# Altium project B106AA.PrjPcb (part 5 of 5)

## Sheet TH Sensor Output Socket.SchDoc: Air Temperature & Air Humidity Sensor Output Socket
size A4; ApprovedBy: Mehmet Günce Akkoyun; CheckedBy: Mehmet Günce Akkoyun; Author: Mehmet Günce Akkoyun; CompanyName: Ovoo Electronics; DrawnBy: Mehmet Günce Akkoyun; Engineer: Mehmet Günce Akkoyun; Organization: Ovoo Electronics; Address1: Küçük Ýhsaniye Mah.; Address2: Mýzraklý Sok. No:15; Address3: Meram / Konya; Address4: Turkiye; DocumentNumber: AA005; Revision: B106AA; SheetNumber: 30; SheetTotal: 37
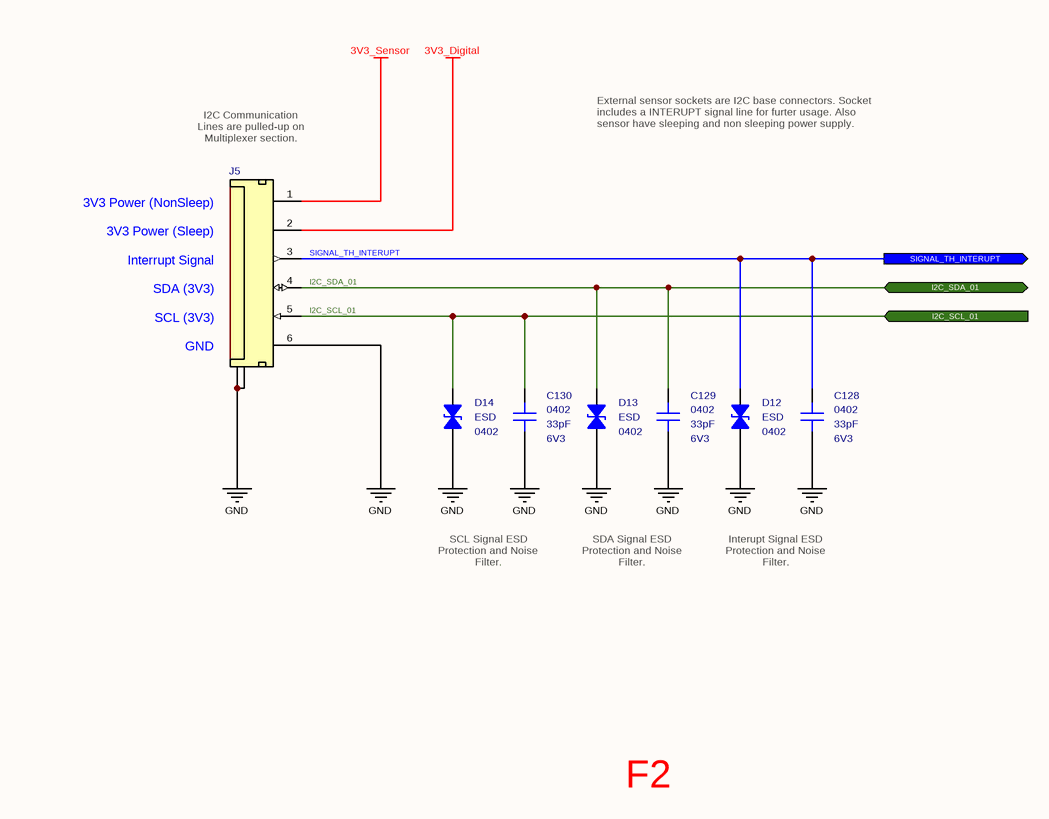
[diagram p35: TH Sensor Output Socket.SchDoc]

### Parts
C128  value 33pF  Case: 0402  Voltage: 6V3  [CAPACITOR_0402]  (hidden comment: Multilayer Ceramic Capacitor)
C129  value 33pF  Case: 0402  Voltage: 6V3  [CAPACITOR_0402]  (hidden comment: Multilayer Ceramic Capacitor)
C130  value 33pF  Case: 0402  Voltage: 6V3  [CAPACITOR_0402]  (hidden comment: Multilayer Ceramic Capacitor)
D12  Case: 0402  [ESD_0402]  (hidden comment: ESD Suppressors)
D13  Case: 0402  [ESD_0402]  (hidden comment: ESD Suppressors)
D14  Case: 0402  [ESD_0402]  (hidden comment: ESD Suppressors)
J5  T/H Sensor Socket  [Connector_Tunic 6P - H]  (value not drawn)

### Ports
I2C_SCL_01 (in), I2C_SDA_01 (bidir), SIGNAL_TH_INTERUPT (out)

### Nets
3V3_Digital: J5.2(3V3_Digital)
3V3_Sensor: J5.1(3V3_Sensor)
GND: C128.1 C129.1 C130.1 D12.1 D13.1 D14.1 J5.6(GND) J5.7(Termination) J5.8(Termination)
I2C_SCL_01: C130.2 D14.2 J5.5(SCL01) ; port I2C_SCL_01
I2C_SDA_01: C129.2 D13.2 J5.4(SDA01) ; port I2C_SDA_01
SIGNAL_TH_INTERUPT: C128.2 D12.2 J5.3(TH_Interupt) ; port SIGNAL_TH_INTERUPT

### Notes on the sheet
- I2C Communication Lines are pulled-up on Multiplexer section.
- External sensor sockets are I2C base connectors. Socket includes a INTERUPT signal line for furter usage. Also sensor have sleeping and non sleeping power supply.
- (near J5) 3V3 Power (NonSleep)
  3V3 Power (Sleep)
  Interrupt Signal
  SDA (3V3)
  SCL (3V3)
  GND
- SCL Signal ESD Protection and Noise Filter.
- SDA Signal ESD Protection and Noise Filter.
- Interupt Signal ESD Protection and Noise Filter.
- F2
- Title
- Size:
- Date:
- A4
- Number:
- Time:
- Revision:
- Sheet
- of
- File:
- (in symbol Diode - ESD Protection) ESD

### Library data of the parts
C128-C130 = Capacitor - 33pF [0402-6V3]: Capacitor - 33pF [0402] (Ceramic); Manufacturer_Name: Kemet; Manufacturer_Part_Number: C0402C330J9RACAUTO; Dielectric: X7R; Tolerance: 10%; Height: 0.5mm; Mouser_Part_Number: 80-C0402C330J9RAUTO; Maximum Operating Temperature: +125; Minimum Operating Temperature: -55; ROHS: Yes; ComponentLink1Description: DataSheet; ComponentLink1URL: https://api.kemet.com/component-edge/download/datasheet/C0402C330J9RACAUTO.pdf; ComponentLink2Description: Mouser; ComponentLink2URL: https://www.mouser.com/Search/Refine.aspx?Keyword=80-C0402C330J9RAUTO; Supplier 1: Mouser; Supplier Part Number 1: 80-C0402C330J9RAUTO
D12-D14 = Diode - ESD Protection: TVS Diode (Bi-directional); Manufacturer_Name: Bussmann / Eaton; Manufacturer_Part_Number: 0402ESDA-MLP1; Clamping Voltage: 35V; Diode Capacitance: 0.05pF; Polarity: Bidirectional; Voltage ESD Air Gap: 15kV; Voltage ESD Contact: 8kV; Working Voltage: 30V; Height: 0.436mm; Mouser_Part_Number: 504-0402ESDA-MLP1; Maximum Operating Temperature: +125; Minimum Operating Temperature: -55; ROHS: Yes; ComponentLink1Description: DataSheet; ComponentLink1URL: https://www.mouser.com.tr/datasheet/2/87/47c59e11-d058-4882-bc35-d8572f2ca054-38826.pdf; ComponentLink2Description: Mouser; ComponentLink2URL: https://www.mouser.com.tr/ProductDetail/Bussmann-Eaton/0402ESDA-MLP1?qs=%2Fha2pyFadughxyc7TyLWeW%2FUvipVY6Ex3naV%2FjpO3plZBZWDLqV4bw%3D%3D; Supplier 1: Mouser; Supplier 2: Digi-Key; Supplier Part Number 2: 283-2964-1-ND; Supplier Part Number 1: 504-0402ESDA-MLP1
J5 = Connector - Mini Tunic 6P (1.25): Mini Tunic Connector with 6P; Manufacturer_Name: Molex; Manufacturer_Part_Number: 53261-0671; ROHS: Yes; Supplier 1: Avnet; Supplier 2: Mouser; Supplier 3: Arrow; Supplier 4: Farnell; Supplier 5: Newark; Supplier 6: Digi-Key; Supplier Part Number 1: 0532610671; Supplier Part Number 2: 538-53261-0671; Supplier Part Number 3: 53261-0671; Supplier Part Number 4: 1125375; Supplier Part Number 5: 93K4246; Supplier Part Number 6: WM7624CT-ND; System: Connector

## Sheet ST Sensor Output Socket.SchDoc: Soil Temperature Sensor Output Socket
size A4; ApprovedBy: Mehmet Günce Akkoyun; CheckedBy: Mehmet Günce Akkoyun; Author: Mehmet Günce Akkoyun; CompanyName: Ovoo Electronics; DrawnBy: Mehmet Günce Akkoyun; Engineer: Mehmet Günce Akkoyun; Organization: Ovoo Electronics; Address1: Küçük Ýhsaniye Mah.; Address2: Mýzraklý Sok. No:15; Address3: Meram / Konya; Address4: Turkiye; DocumentNumber: AA005; Revision: B106AA; SheetNumber: 31; SheetTotal: 37
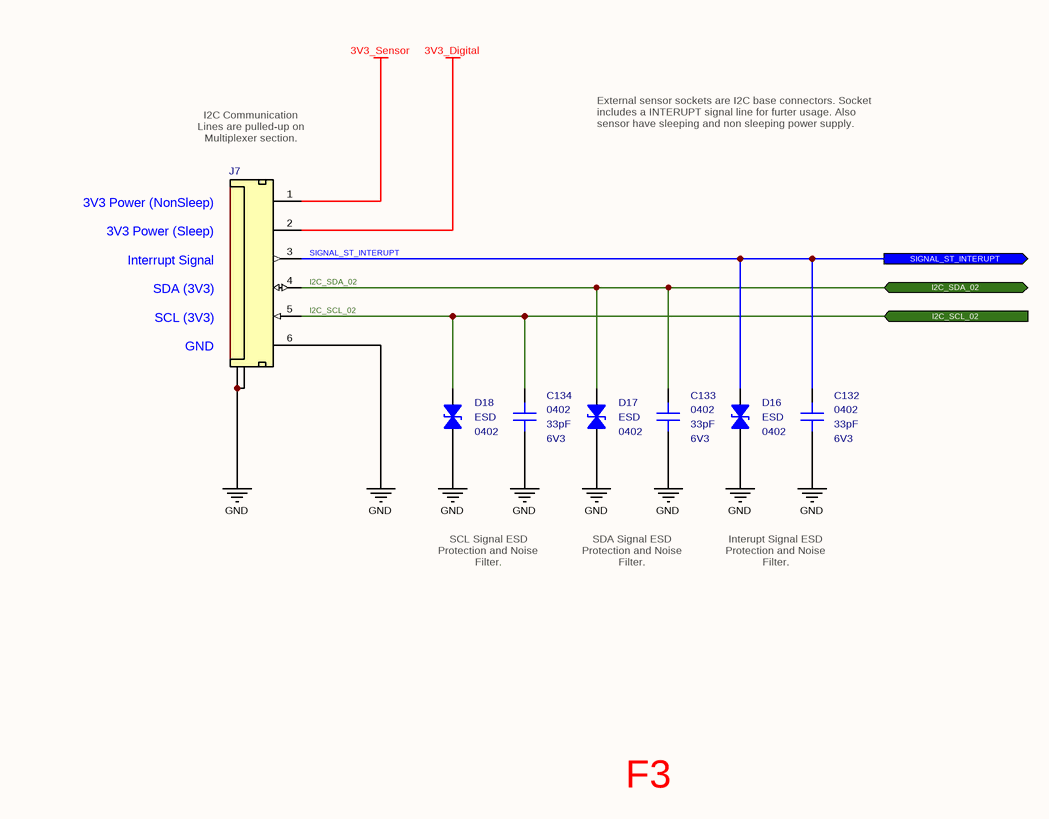
[diagram p36: ST Sensor Output Socket.SchDoc]

### Parts
C132  value 33pF  Case: 0402  Voltage: 6V3  [CAPACITOR_0402]  (hidden comment: Multilayer Ceramic Capacitor)
C133  value 33pF  Case: 0402  Voltage: 6V3  [CAPACITOR_0402]  (hidden comment: Multilayer Ceramic Capacitor)
C134  value 33pF  Case: 0402  Voltage: 6V3  [CAPACITOR_0402]  (hidden comment: Multilayer Ceramic Capacitor)
D16  Case: 0402  [ESD_0402]  (hidden comment: ESD Suppressors)
D17  Case: 0402  [ESD_0402]  (hidden comment: ESD Suppressors)
D18  Case: 0402  [ESD_0402]  (hidden comment: ESD Suppressors)
J7  ST Sensor Socket  [Connector_Tunic 6P - H]  (value not drawn)

### Ports
I2C_SCL_02 (in), I2C_SDA_02 (bidir), SIGNAL_ST_INTERUPT (out)

### Nets
3V3_Digital: J7.2(3V3_Digital)
3V3_Sensor: J7.1(3V3_Sensor)
GND: C132.1 C133.1 C134.1 D16.1 D17.1 D18.1 J7.6(GND) J7.7(Termination) J7.8(Termination)
I2C_SCL_02: C134.2 D18.2 J7.5(SCL02) ; port I2C_SCL_02
I2C_SDA_02: C133.2 D17.2 J7.4(SDA02) ; port I2C_SDA_02
SIGNAL_ST_INTERUPT: C132.2 D16.2 J7.3(ST_Interupt) ; port SIGNAL_ST_INTERUPT

### Notes on the sheet
- I2C Communication Lines are pulled-up on Multiplexer section.
- External sensor sockets are I2C base connectors. Socket includes a INTERUPT signal line for furter usage. Also sensor have sleeping and non sleeping power supply.
- (near J7) 3V3 Power (NonSleep)
  3V3 Power (Sleep)
  Interrupt Signal
  SDA (3V3)
  SCL (3V3)
  GND
- SCL Signal ESD Protection and Noise Filter.
- SDA Signal ESD Protection and Noise Filter.
- Interupt Signal ESD Protection and Noise Filter.
- F3
- Title
- Size:
- Date:
- A4
- Number:
- Time:
- Revision:
- Sheet
- of
- File:
- (in symbol Diode - ESD Protection) ESD

### Library data of the parts
C132-C134 = Capacitor - 33pF [0402-6V3]: as C128 on sheet TH Sensor Output Socket; Height: 0.5mm; Mouser_Part_Number: 80-C0402C330J9RAUTO; Maximum Operating Temperature: +125; Minimum Operating Temperature: -55; ROHS: Yes; ComponentLink1Description: DataSheet; ComponentLink1URL: https://api.kemet.com/component-edge/download/datasheet/C0402C330J9RACAUTO.pdf; ComponentLink2Description: Mouser; ComponentLink2URL: https://www.mouser.com/Search/Refine.aspx?Keyword=80-C0402C330J9RAUTO; Supplier 1: Mouser; Supplier Part Number 1: 80-C0402C330J9RAUTO
D16-D18 = Diode - ESD Protection: as D12 on sheet TH Sensor Output Socket; Height: 0.436mm; Mouser_Part_Number: 504-0402ESDA-MLP1; Maximum Operating Temperature: +125; Minimum Operating Temperature: -55; ROHS: Yes; ComponentLink1Description: DataSheet; ComponentLink1URL: https://www.mouser.com.tr/datasheet/2/87/47c59e11-d058-4882-bc35-d8572f2ca054-38826.pdf; ComponentLink2Description: Mouser; ComponentLink2URL: https://www.mouser.com.tr/ProductDetail/Bussmann-Eaton/0402ESDA-MLP1?qs=%2Fha2pyFadughxyc7TyLWeW%2FUvipVY6Ex3naV%2FjpO3plZBZWDLqV4bw%3D%3D; Supplier 1: Mouser; Supplier 2: Digi-Key; Supplier Part Number 2: 283-2964-1-ND; Supplier Part Number 1: 504-0402ESDA-MLP1
J7 = Connector - Mini Tunic 6P (1.25): as J5 on sheet TH Sensor Output Socket; ROHS: Yes; Supplier 1: Avnet; Supplier 2: Mouser; Supplier 3: Arrow; Supplier 4: Farnell; Supplier 5: Newark; Supplier 6: Digi-Key; Supplier Part Number 1: 0532610671; Supplier Part Number 2: 538-53261-0671; Supplier Part Number 3: 53261-0671; Supplier Part Number 4: 1125375; Supplier Part Number 5: 93K4246; Supplier Part Number 6: WM7624CT-ND; System: Connector

## Sheet Pressure Sensor.SchDoc: Pressure Sensor
size A4; ApprovedBy: Mehmet Günce Akkoyun; CheckedBy: Mehmet Günce Akkoyun; Author: Mehmet Günce Akkoyun; CompanyName: Ovoo Electronics; DrawnBy: Mehmet Günce Akkoyun; Engineer: Mehmet Günce Akkoyun; Organization: Ovoo Electronics; Address1: Küçük Ýhsaniye Mah.; Address2: Mýzraklý Sok. No:15; Address3: Meram / Konya; Address4: Turkiye; DocumentNumber: AA005; Revision: B106AA; SheetNumber: 32; SheetTotal: 37
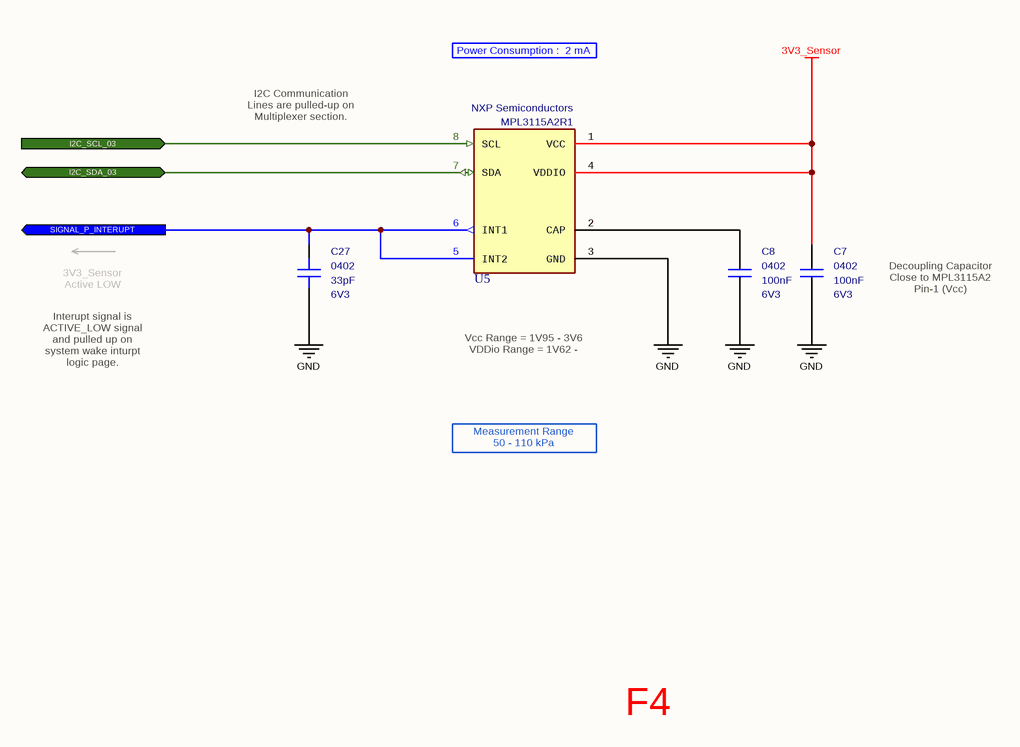
[diagram p37: Pressure Sensor.SchDoc]

### Parts
C7  value 100nF  Case: 0402  Voltage: 6V3  [CAPACITOR_0402]  (hidden comment: Multilayer Ceramic Capacitor)
C8  value 100nF  Case: 0402  Voltage: 6V3  [CAPACITOR_0402]  (hidden comment: Multilayer Ceramic Capacitor)
C27  value 33pF  Case: 0402  Voltage: 6V3  [CAPACITOR_0402]  (hidden comment: Multilayer Ceramic Capacitor)
U5  Manufacturer_Part_Number: MPL3115A2R1  Manufacturer_Name: NXP Semiconductors  [MPL3115A2]  (hidden comment: Board Mount Pressure Sensors)

### Ports
I2C_SCL_03 (in), I2C_SDA_03 (bidir), SIGNAL_P_INTERUPT (out)

### Nets
3V3_Sensor: C7.2 U5.1(VCC) U5.4(VDDIO)
GND: C7.1 C8.1 C27.1 U5.3(GND)
I2C_SCL_03: U5.8(SCL) ; port I2C_SCL_03
I2C_SDA_03: U5.7(SDA) ; port I2C_SDA_03
SIGNAL_P_INTERUPT: C27.2 U5.5(INT2) U5.6(INT1) ; port SIGNAL_P_INTERUPT
NetC8_2: C8.2 U5.2(CAP)

### Notes on the sheet
- Power Consumption :  2 mA
- I2C Communication Lines are pulled-up on Multiplexer section.
- 3V3_Sensor
  Active LOW
- Decoupling Capacitor
  Close to MPL3115A2
  Pin-1 (Vcc)
- Interupt signal is ACTIVE_LOW signal and pulled up on system wake inturpt logic page.
- Vcc Range = 1V95 - 3V6
  VDDio Range = 1V62 - 3V6
- Measurement Range
  50 - 110 kPa
- F4
- Title
- Size:
- Date:
- A4
- Number:
- Time:
- Revision:
- Sheet
- of
- File:

### Library data of the parts
C7 C8 = Capacitor - 100nF [0402-6V3]: Capacitor - 100nF [0402-6V3] (Ceramic); Manufacturer_Name: AVX; Manufacturer_Part_Number: 04026D104KAT4A; Dielectric: X5R; Tolerance: %10; Height: 0.25mm; Mouser_Part_Number: 581-04026D104KAT4A; ComponentLink1Description: Mouser; ComponentLink1URL: https://www.mouser.com.tr/ProductDetail/AVX/04026D104KAT4A?qs=sGAEpiMZZMs0AnBnWHyRQPg4iYkCw7IMED%2F4kpqgf7w%3D; ComponentLink2Description: DataSheet; ComponentLink2URL: https://www.mouser.com.tr/datasheet/2/40/cx5r-776519.pdf; ROHS: Yes; Maximum Operating Temperature: +85; Minimum Operating Temperature: -55; Supplier 1: Avnet; Supplier Part Number 1: 04026D104KAT4A
C27 = Capacitor - 33pF [0402-6V3]: as C128 on sheet TH Sensor Output Socket; Height: 0.5mm; Mouser_Part_Number: 80-C0402C330J9RAUTO; Maximum Operating Temperature: +125; Minimum Operating Temperature: -55; ROHS: Yes; ComponentLink1Description: DataSheet; ComponentLink1URL: https://api.kemet.com/component-edge/download/datasheet/C0402C330J9RACAUTO.pdf; ComponentLink2Description: Mouser; ComponentLink2URL: https://www.mouser.com/Search/Refine.aspx?Keyword=80-C0402C330J9RAUTO; Supplier 1: Mouser; Supplier Part Number 1: 80-C0402C330J9RAUTO
U5 = IC - MPL3115A2R1: Board Mount Pressure Sensors I 2 C VERSION; Mouser Part Number: 841-MPL3115A2R1; ComponentLink1Description: DataSheet; ComponentLink1URL: https://www.mouser.com.tr/datasheet/2/302/MPL3115A2-1127148.pdf; ComponentLink2Description: Mouser; ComponentLink2URL: https://www.mouser.com.tr/ProductDetail/NXP-Semiconductors/MPL3115A2R1?qs=6ddF3R%2F6EV%2Fx8daKoNGetQ%3D%3D; Minimum Operating Temperature: -40; Maximum Operating Temperature: +85; Case: SMD; Supplier 1: Farnell; Supplier Part Number 1: 2890337

## Sheet Capacitive Rain Sensor.SchDoc: Capacitive Rain Sensor
size A4; ApprovedBy: Mehmet Günce Akkoyun; CheckedBy: Mehmet Günce Akkoyun; Author: Mehmet Günce Akkoyun; CompanyName: Ovoo Electronics; DrawnBy: Mehmet Günce Akkoyun; Engineer: Mehmet Günce Akkoyun; Organization: Ovoo Electronics; Address1: Küçük Ýhsaniye Mah.; Address2: Mýzraklý Sok. No:15; Address3: Meram / Konya; Address4: Turkiye; DocumentNumber: AA005; Revision: B106AA; SheetNumber: 33; SheetTotal: 37
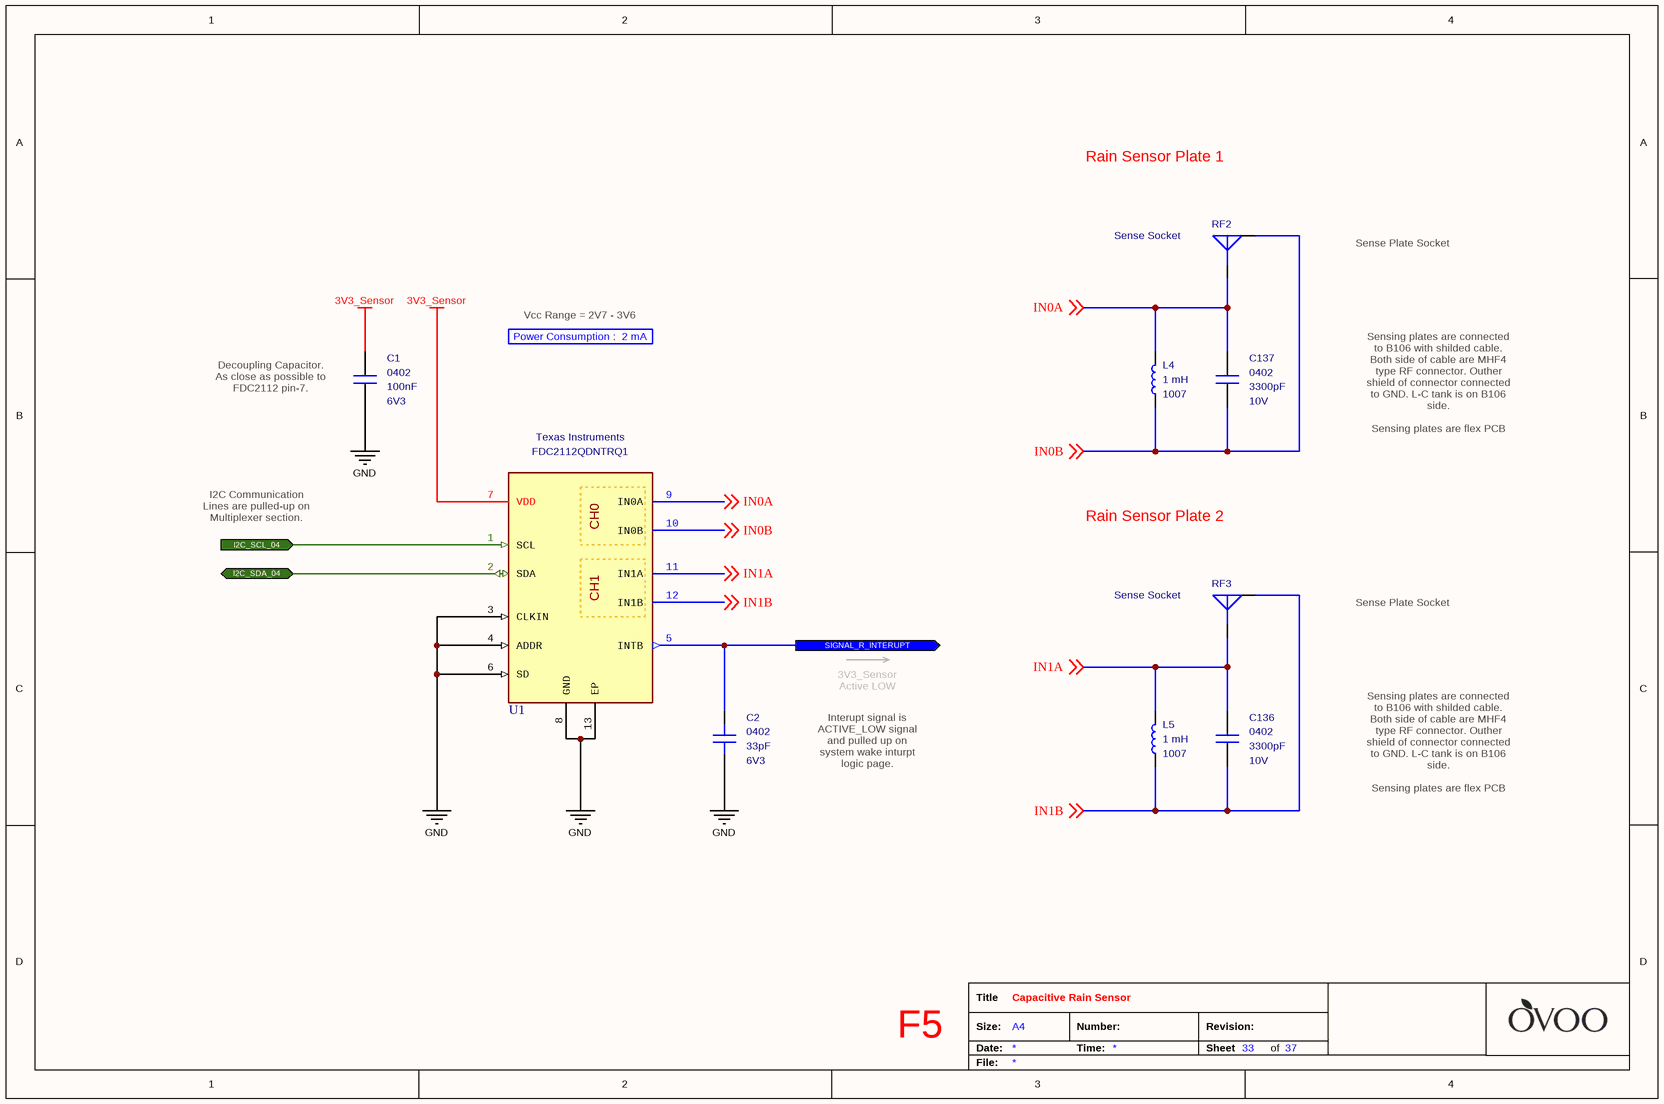
[diagram p38: Capacitive Rain Sensor.SchDoc]

### Parts
C1  value 100nF  Case: 0402  Voltage: 6V3  [CAPACITOR_0402]  (hidden comment: Multilayer Ceramic Capacitor)
C2  value 33pF  Case: 0402  Voltage: 6V3  [CAPACITOR_0402]  (hidden comment: Multilayer Ceramic Capacitor)
C136  value 3300pF  Case: 0402  Voltage: 10V  [CAPACITOR_0402]  (hidden comment: Multilayer Ceramic Capacitors)
C137  value 3300pF  Case: 0402  Voltage: 10V  [CAPACITOR_0402]  (hidden comment: Multilayer Ceramic Capacitors)
L4  value 1 mH  Case: 1007  [INDUCTOR_1007]  (hidden comment: Fixed Inductor)
L5  value 1 mH  Case: 1007  [INDUCTOR_1007]  (hidden comment: Fixed Inductor)
RF2  Sense Socket  [Connector_IPEX]
RF3  Sense Socket  [Connector_IPEX]
U1  Manufacturer_Part_Number: FDC2112QDNTRQ1  Manufacturer_Name: Texas Instruments  [Texas_DNT]  (hidden comment: Capacitive Sensor)

### Ports
I2C_SCL_04 (in), I2C_SDA_04 (bidir), SIGNAL_R_INTERUPT (out)

### Nets
3V3_Sensor: C1.2 U1.7(VDD)
GND: C1.1 C2.1 U1.3(CLKIN) U1.4(ADDR) U1.6(SD) U1.8(GND) U1.13(EP)
I2C_SCL_04: U1.1(SCL) ; port I2C_SCL_04
I2C_SDA_04: U1.2(SDA) ; port I2C_SDA_04
IN0A: C137.2 L4.2 RF2.1(Signal) U1.9(IN0A) ; off-sheet IN0A
IN0B: C137.1 L4.1 RF2.2(GND) U1.10(IN0B) ; off-sheet IN0B
IN1A: C136.2 L5.2 RF3.1(Signal) U1.11(IN1A) ; off-sheet IN1A
IN1B: C136.1 L5.1 RF3.2(GND) U1.12(IN1B) ; off-sheet IN1B
SIGNAL_R_INTERUPT: C2.2 U1.5(INTB) ; port SIGNAL_R_INTERUPT

### Notes on the sheet
- Rain Sensor Plate 1
- Sense Plate Socket
- Vcc Range = 2V7 - 3V6
- (near C1) Decoupling Capacitor. As close as possible to FDC2112 pin-7.
- Power Consumption :  2 mA
- Sensing plates are connected to B106 with shilded cable. Both side of cable are MHF4 type RF connector. Outher shield of connector connected to GND. L-C tank is on B106 side.
  Sensing plates are flex PCB and stick to inside of enclosure.
- I2C Communication Lines are pulled-up on Multiplexer section.
- Rain Sensor Plate 2
- 3V3_Sensor
  Active LOW
- Interupt signal is ACTIVE_LOW signal and pulled up on system wake inturpt logic page.
- F5
- Title
- Size:
- Date:
- A4
- Number:
- Time:
- Revision:
- Sheet
- of
- File:
- (in symbol IC - FDC2112QDNTRQ1) CH0; CH1

### Library data of the parts
C1 = Capacitor - 100nF [0402-6V3]: as C7 on sheet Pressure Sensor; Height: 0.25mm; Mouser_Part_Number: 581-04026D104KAT4A; ComponentLink1Description: Mouser; ComponentLink1URL: https://www.mouser.com.tr/ProductDetail/AVX/04026D104KAT4A?qs=sGAEpiMZZMs0AnBnWHyRQPg4iYkCw7IMED%2F4kpqgf7w%3D; ComponentLink2Description: DataSheet; ComponentLink2URL: https://www.mouser.com.tr/datasheet/2/40/cx5r-776519.pdf; ROHS: Yes; Maximum Operating Temperature: +85; Minimum Operating Temperature: -55; Supplier 1: Avnet; Supplier Part Number 1: 04026D104KAT4A
C2 = Capacitor - 33pF [0402-6V3]: as C128 on sheet TH Sensor Output Socket; Height: 0.5mm; Mouser_Part_Number: 80-C0402C330J9RAUTO; Maximum Operating Temperature: +125; Minimum Operating Temperature: -55; ROHS: Yes; ComponentLink1Description: DataSheet; ComponentLink1URL: https://api.kemet.com/component-edge/download/datasheet/C0402C330J9RACAUTO.pdf; ComponentLink2Description: Mouser; ComponentLink2URL: https://www.mouser.com/Search/Refine.aspx?Keyword=80-C0402C330J9RAUTO; Supplier 1: Mouser; Supplier Part Number 1: 80-C0402C330J9RAUTO
C136 C137 = Capacitor - 3300pF [0402-10V): Capacitor - 3300pF [0402] (Ceramic); Manufacturer_Name: Vishay; Manufacturer_Part_Number: VJ0402Y332KXQCW1BC; Dielectric: X7R; Tolerance: %10; Height: 0.5mm; Mouser_Part_Number: 77-VJ0402Y332KXQCBC; ComponentLink1Description: Mouser; ComponentLink1URL: https://www.mouser.com.tr/ProductDetail/Vishay-Vitramon/VJ0402Y332KXQCW1BC?qs=KbkO2%2FpCUcHZJP6qGqcwFw%3D%3D; ComponentLink2Description: DataSheet; ComponentLink2URL: https://www.mouser.com.tr/datasheet/2/427/vjw1bcbascomseries-1762447.pdf; ROHS: Yes; Maximum Operating Temperature: +125; Minimum Operating Temperature: -55; Supplier 1: Mouser; Supplier Part Number 1: 77-VJ0402Y332KXQCBC
L4 L5 = Inductor - 1mH [1007]: Manufacturer_Name: Taiyo Yuden; Manufacturer_Part_Number: CB2518T102K; Height: 1.8mm; Mouser_Part_Number: 963-CB2518T102K; ComponentLink1Description: DataSheet; ComponentLink1URL: https://www.mouser.com.tr/datasheet/2/396/wound02_e-13113-1206718.pdf; ComponentLink2Description: Mouser; ComponentLink2URL: https://www.mouser.com.tr/ProductDetail/Taiyo-Yuden/CB2518T102K?qs=I6KAKw0tg2xhj02bt1Q%2F3g%3D%3D; Supplier 1: Mouser; Supplier 2: Farnell; Supplier 3: Newark; Supplier 4: Digi-Key; Supplier Part Number 1: 963-CB2518T102K; Supplier Part Number 2: 2084589; Supplier Part Number 3: 04R7508; Supplier Part Number 4: 587-2195-1-ND
RF2 RF3 = Connector - MHF: Sense Plate Connection Socket; ROHS: Yes; Supplier 1: Mouser; Supplier 2: Arrow; Supplier Part Number 1: 200-RSP-122811-01; Supplier Part Number 2: RSP-122811-01; System: Connector
U1 = IC - FDC2112QDNTRQ1: Mouser Part Number: 595-FDC2112QDNTRQ1; ComponentLink1Description: DataSheet; ComponentLink1URL: http://www.ti.com/general/docs/suppproductinfo.tsp?distId=26&gotoUrl=http%3A%2F%2Fwww.ti.com%2Flit%2Fgpn%2Ffdc2112-q1; ComponentLink2Description: Mouser; ComponentLink2URL: https://www.mouser.com.tr/ProductDetail/Texas-Instruments/FDC2112QDNTRQ1?qs=zEmsApcVOkVPXFPq8EWl0A%3D%3D; Supplier 1: Mouser; Supplier 2: Arrow; Supplier Part Number 1: 595-FDC2112QDNTRQ1; Supplier Part Number 2: FDC2112QDNTRQ1; Case: WSON-12

## Sheet Real Time Clock.SchDoc: Real Time Clock
size A4; ApprovedBy: Mehmet Günce Akkoyun; CheckedBy: Mehmet Günce Akkoyun; Author: Mehmet Günce Akkoyun; CompanyName: Ovoo Electronics; DrawnBy: Mehmet Günce Akkoyun; Engineer: Mehmet Günce Akkoyun; Organization: Ovoo Electronics; Address1: Küçük Ýhsaniye Mah.; Address2: Mýzraklý Sok. No:15; Address3: Meram / Konya; Address4: Turkiye; DocumentNumber: AA005; Revision: B106AA; SheetNumber: 36; SheetTotal: 37
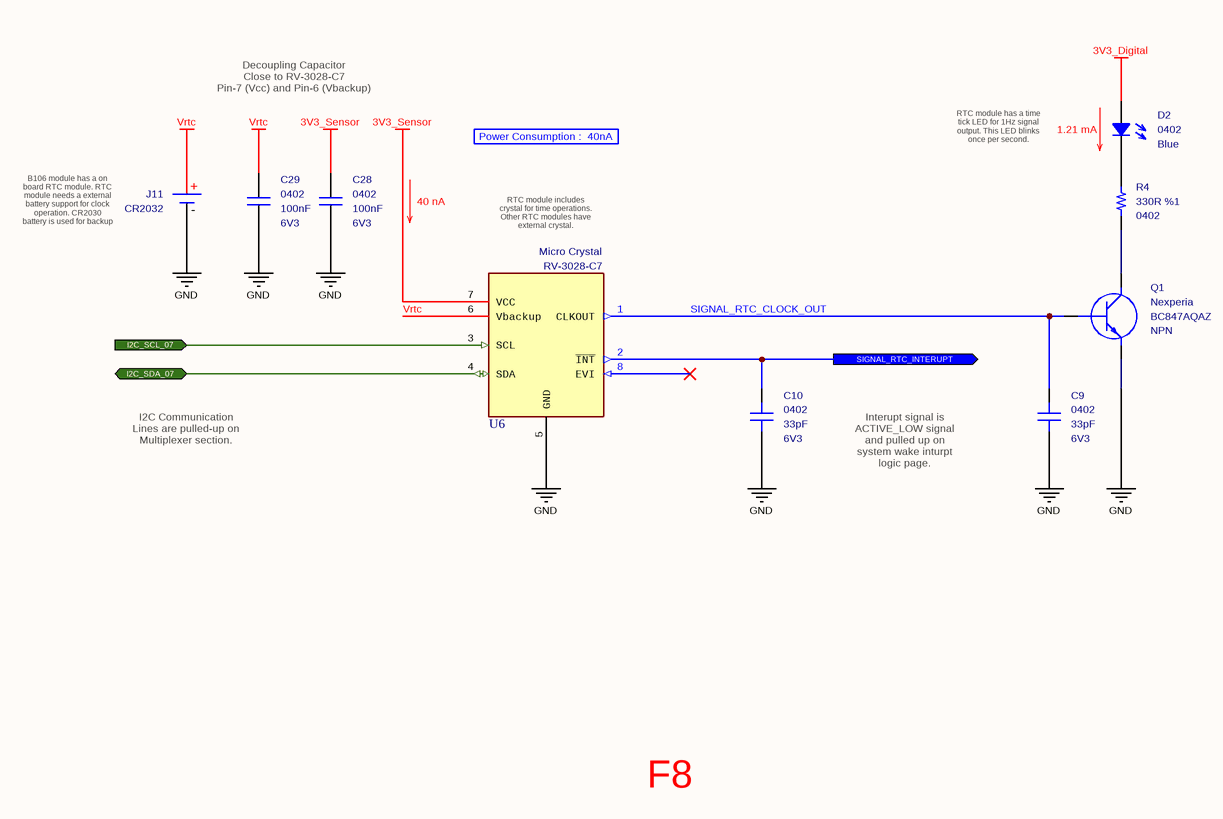
[diagram p39: Real Time Clock.SchDoc]

### Parts
C9  value 33pF  Case: 0402  Voltage: 6V3  [CAPACITOR_0402]  (hidden comment: Multilayer Ceramic Capacitor)
C10  value 33pF  Case: 0402  Voltage: 6V3  [CAPACITOR_0402]  (hidden comment: Multilayer Ceramic Capacitor)
C28  value 100nF  Case: 0402  Voltage: 6V3  [CAPACITOR_0402]  (hidden comment: Multilayer Ceramic Capacitor)
C29  value 100nF  Case: 0402  Voltage: 6V3  [CAPACITOR_0402]  (hidden comment: Multilayer Ceramic Capacitor)
D2  Case: 0402  Color: Blue  [LED_0402]  (hidden comment: SMD LED (Blue))
J11  Battery Size: CR2032  [BATTERY_HOLDER - CR2032]  (hidden comment: Battery Clip Holder and Battery)
Q1  Manufacturer_Name: Nexperia  Manufacturer_Part_Number: BC847AQAZ  Polarity: NPN  [SOT1215]  (hidden comment: Bipolar NPN Transistors)
R4  value 330R  Tolerance: %1  Case: 0402  [RESISTOR_0402]  (hidden comment: Thick Film Resistor)
U6  Manufacturer_Name: Micro Crystal  [RV-3028-C7]  (hidden comment: Real Time Clock)

### Ports
I2C_SCL_07 (in), I2C_SDA_07 (bidir), SIGNAL_RTC_INTERUPT (out)

### Nets
3V3_Digital: D2.2
3V3_Sensor: C28.2 U6.7(VCC)
GND: C9.2 C10.2 C28.1 C29.1 J11.2(BAT-) Q1.2(E) U6.5(GND)
Vrtc: C29.2 J11.1(BAT+) U6.6(Vbackup)
I2C_SCL_07: U6.3(SCL) ; port I2C_SCL_07
I2C_SDA_07: U6.4(SDA) ; port I2C_SDA_07
SIGNAL_RTC_CLOCK_OUT: C9.1 Q1.1(B) U6.1(CLKOUT)
SIGNAL_RTC_INTERUPT: C10.1 U6.2(~{INT}) ; port SIGNAL_RTC_INTERUPT
NetD2_1: D2.1 R4.2
NetQ1_3: Q1.3(C) R4.1

Not connected (* = marked no-connect by the designer): U6 8(EVI)*

### Notes on the sheet
- Decoupling Capacitor
  Close to RV-3028-C7
  Pin-7 (Vcc) and Pin-6 (Vbackup)
- Power Consumption :  40nA
- RTC module has a time tick LED for 1Hz signal output. This LED blinks once per second.
- (near D2) 1.21 mA
- B106 module has a on board RTC module. RTC module needs a external battery support for clock operation. CR2030 battery is used for backup power.
- 40 nA
- RTC module includes crystal for time operations. Other RTC modules have external crystal.
- I2C Communication Lines are pulled-up on Multiplexer section.
- Interupt signal is ACTIVE_LOW signal and pulled up on system wake inturpt logic page.
- F8
- Title
- Size:
- Date:
- A4
- Number:
- Time:
- Revision:
- Sheet
- of
- File:
- (in symbol Connector - Battery Holder (CR2032)) +; -

### Library data of the parts
C9 C10 = Capacitor - 33pF [0402-6V3]: as C128 on sheet TH Sensor Output Socket; Height: 0.5mm; Mouser_Part_Number: 80-C0402C330J9RAUTO; Maximum Operating Temperature: +125; Minimum Operating Temperature: -55; ROHS: Yes; ComponentLink1Description: DataSheet; ComponentLink1URL: https://api.kemet.com/component-edge/download/datasheet/C0402C330J9RACAUTO.pdf; ComponentLink2Description: Mouser; ComponentLink2URL: https://www.mouser.com/Search/Refine.aspx?Keyword=80-C0402C330J9RAUTO; Supplier 1: Mouser; Supplier Part Number 1: 80-C0402C330J9RAUTO
C28 C29 = Capacitor - 100nF [0402-6V3]: as C7 on sheet Pressure Sensor; Height: 0.25mm; Mouser_Part_Number: 581-04026D104KAT4A; ComponentLink1Description: Mouser; ComponentLink1URL: https://www.mouser.com.tr/ProductDetail/AVX/04026D104KAT4A?qs=sGAEpiMZZMs0AnBnWHyRQPg4iYkCw7IMED%2F4kpqgf7w%3D; ComponentLink2Description: DataSheet; ComponentLink2URL: https://www.mouser.com.tr/datasheet/2/40/cx5r-776519.pdf; ROHS: Yes; Maximum Operating Temperature: +85; Minimum Operating Temperature: -55; Supplier 1: Avnet; Supplier Part Number 1: 04026D104KAT4A
D2 = Diode - LED (0402-Blue): Standard LEDs - SMD PICOLEDTM;BLUE LED; 25M @ 5MA; Manufacturer_Name: ROHM Semiconductor; Manufacturer_Part_Number: SMLP13BC8TT86; Mouser_Part_Number: 755-SMLP13BC8TT86; ROHS: Yes; ComponentLink1Description: DataSheet; ComponentLink1URL: https://d1d2qsbl8m0m72.cloudfront.net/en/products/databook/datasheet/opto/led/chip_mono/sml-p1-e.pdf; ComponentLink2Description: Mouser; ComponentLink2URL: https://www.mouser.com.tr/ProductDetail/ROHM-Semiconductor/SMLP13BC8TT86?qs=%2Fha2pyFaduidYDgXFKL%252BNZwCVZNUI4FlyPWWbVDx1b6ABmzS%252BS2f0w%3D%3D; Supplier 1: Mouser; Supplier 2: Digi-Key; Supplier Part Number 1: 755-SMLP13BC8TT86; Supplier Part Number 2: 846-1112-1-ND
J11 = Connector - Battery Holder (CR2032): Cylindrical Battery Contacts, Clips, Holders & Springs 16MM - 19MM SM BATTERY CLIP; Manufacturer_Name: Keystone Electronics; Manufacturer_Part_Number: 1070TR; ROHS: Yes; ComponentLink1Description: DataSheet; ComponentLink1URL: https://eu.mouser.com/datasheet/2/215/070-837768.pdf; ComponentLink2Description: Mouser; ComponentLink2URL: https://eu.mouser.com/ProductDetail/Keystone-Electronics/1070TR?qs=sGAEpiMZZMvacfJXZtNRX8uRXKXXLkuh9KDEDSooOoo%3D; Mouser_Part_Number: 534-1070TR; Supplier 1: Farnell; Supplier 2: Digi-Key; Supplier Part Number 1: 2960510; Supplier Part Number 2: 36-1070CT-ND
Q1 = Transistor - BC847: Bipolar Transistors - BJT BC847AQA/DFN1010D-3/REEL 7" Q2; Mouser_Part_Number: 771-BC847AQAZ; ComponentLink1Description: DataSheet; ComponentLink1URL: https://www.mouser.com.tr/datasheet/2/916/BC847XQA_SER-1598405.pdf; ComponentLink2Description: Mouser; ComponentLink2URL: https://www.mouser.com.tr/ProductDetail/Nexperia/BC847AQAZ?qs=%2Fha2pyFaduhKMCPKNtQimeJpXTw9z4AqURd2YARs8DVICZNv3AT9Dw%3D%3D; Case: DFN-1010D-3; Supplier 1: Mouser; Supplier 2: Digi-Key; Supplier Part Number 1: 771-BC847AQAZ; Supplier Part Number 2: 1727-2545-1-ND
R4 = Resistor - 330R: Thick Film Resistors - SMD 1/16 W 330 Ohm 1%; Manufacturer_Name: Vishay; Manufacturer_Part_Number: CRCW0402330RFKED; Height: 0.4mm; Mouser_Part_Number: 71-CRCW0402-330-E3; ComponentLink1Description: DataSheet; ComponentLink1URL: https://www.mouser.com.tr/datasheet/2/427/dcrcwe3-1762152.pdf; ComponentLink2Description: Mouser; ComponentLink2URL: https://www.mouser.com.tr/ProductDetail/Vishay-Dale/CRCW0402330RFKED?qs=sGAEpiMZZMu61qfTUdNhG2DpbjADlD3GGS6SwBlLi5Q%3D; Supplier 1: Mouser; Supplier 2: Digi-Key; Supplier Part Number 2: 541-330LCT-ND; Supplier Part Number 1: 71-CRCW0402-330-E3
U6 = IC - RV-3028-C7: Real Time Clock 32.768kHz I2C Time Acc. 1ppm; Mouser_Part_Number: 428-203591-MG01; ComponentLink1Description: DataSheet; ComponentLink1URL: https://eu.mouser.com/datasheet/2/530/RV-3028-C7-1524919.pdf; ComponentLink2Description: Mouser; ComponentLink2URL: https://eu.mouser.com/ProductDetail/Micro-Crystal/RV-3028-C7-32768kHz-1ppm-TA-QC?qs=sGAEpiMZZMtpeOq%2F1QMb1b6mUOvJOzpDTOpQRtK3%252B9k%3D; Minimum Operating Temperature: -40; Maximum Operating Temperature: +85; Supplier 1: Digi-Key; Supplier Part Number 1: 2195-RV-3028-C732.768KHZ1PPM-TA-QCCT-ND; Case: SMD; Manufacturer_Part_Number: RV-3028-C7

## Sheet I2C IO Expander.SchDoc: I2C I/O Expander for Reading Interrupts
size A4; ApprovedBy: Mehmet Günce Akkoyun; CheckedBy: Mehmet Günce Akkoyun; Author: Mehmet Günce Akkoyun; CompanyName: Ovoo Electronics; DrawnBy: Mehmet Günce Akkoyun; Engineer: Mehmet Günce Akkoyun; Organization: Ovoo Electronics; Address1: Küçük Ýhsaniye Mah.; Address2: Mýzraklý Sok. No:15; Address3: Meram / Konya; Address4: Turkiye; DocumentNumber: AA005; Revision: B106AA; SheetNumber: 35; SheetTotal: 37
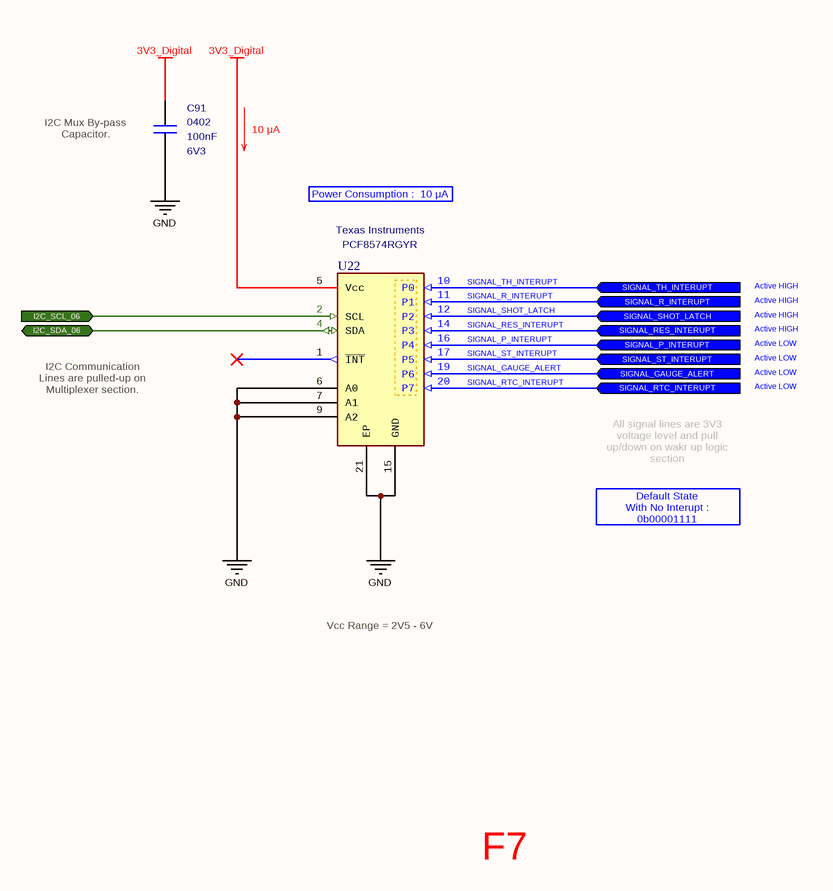
[diagram p40: I2C IO Expander.SchDoc]

### Parts
C91  value 100nF  Case: 0402  Voltage: 6V3  [CAPACITOR_0402]  (hidden comment: Multilayer Ceramic Capacitor)
U22  Manufacturer_Part_Number: PCF8574RGYR  Manufacturer_Name: Texas Instruments  [VQFN20]  (hidden comment: I2C I/O Expander)

### Ports
I2C_SCL_06 (in), I2C_SDA_06 (bidir), SIGNAL_GAUGE_ALERT (in), SIGNAL_P_INTERUPT (in), SIGNAL_R_INTERUPT (in), SIGNAL_RES_INTERUPT (in), SIGNAL_RTC_INTERUPT (in), SIGNAL_SHOT_LATCH (in), SIGNAL_ST_INTERUPT (in), SIGNAL_TH_INTERUPT (in)

### Nets
3V3_Digital: C91.2 U22.5(Vcc)
GND: C91.1 U22.6(A0) U22.7(A1) U22.9(A2) U22.15(GND) U22.21(EP)
I2C_SCL_06: U22.2(SCL) ; port I2C_SCL_06
I2C_SDA_06: U22.4(SDA) ; port I2C_SDA_06
SIGNAL_GAUGE_ALERT: U22.19(P6) ; port SIGNAL_GAUGE_ALERT
SIGNAL_P_INTERUPT: U22.16(P4) ; port SIGNAL_P_INTERUPT
SIGNAL_R_INTERUPT: U22.11(P1) ; port SIGNAL_R_INTERUPT
SIGNAL_RES_INTERUPT: U22.14(P3) ; port SIGNAL_RES_INTERUPT
SIGNAL_RTC_INTERUPT: U22.20(P7) ; port SIGNAL_RTC_INTERUPT
SIGNAL_SHOT_LATCH: U22.12(P2) ; port SIGNAL_SHOT_LATCH
SIGNAL_ST_INTERUPT: U22.17(P5) ; port SIGNAL_ST_INTERUPT
SIGNAL_TH_INTERUPT: U22.10(P0) ; port SIGNAL_TH_INTERUPT

Not connected (* = marked no-connect by the designer): U22 1(~{INT})*

### Notes on the sheet
- (near C91) I2C Mux By-pass Capacitor.
- 10 μA
- Power Consumption :  10 μA
- Active HIGH
- Active LOW
- I2C Communication Lines are pulled-up on Multiplexer section.
- All signal lines are 3V3
  voltage level and pull up/down on wakr up logic section
- Default State
  With No Interupt :
  0b00001111
- Vcc Range = 2V5 - 6V
- F7
- Title
- Size:
- Date:
- A4
- Number:
- Time:
- Revision:
- Sheet
- of
- File:

### Library data of the parts
C91 = Capacitor - 100nF [0402-6V3]: as C7 on sheet Pressure Sensor; Height: 0.25mm; Mouser_Part_Number: 581-04026D104KAT4A; ComponentLink1Description: Mouser; ComponentLink1URL: https://www.mouser.com.tr/ProductDetail/AVX/04026D104KAT4A?qs=sGAEpiMZZMs0AnBnWHyRQPg4iYkCw7IMED%2F4kpqgf7w%3D; ComponentLink2Description: DataSheet; ComponentLink2URL: https://www.mouser.com.tr/datasheet/2/40/cx5r-776519.pdf; ROHS: Yes; Maximum Operating Temperature: +85; Minimum Operating Temperature: -55; Supplier 1: Avnet; Supplier Part Number 1: 04026D104KAT4A
U22 = IC - PCF8574RGYR: Interface - I/O Expanders Remote 8-Bit I/O Expander for I2C-Bus; Maximum Clock Frequency: 100kHz; Operating Supply Voltage: 2V5-6V; Number of I/Os: 8; Mouser_Part_Number: 595-PCF8574RGYR; ComponentLink1Description: DataSheet; ComponentLink1URL: http://www.ti.com/general/docs/suppproductinfo.tsp?distId=26&gotoUrl=http%3A%2F%2Fwww.ti.com%2Flit%2Fgpn%2Fpcf8574; ComponentLink2Description: Mouser; ComponentLink2URL: https://www.mouser.com.tr/ProductDetail/Texas-Instruments/PCF8574RGYR?qs=%2Fha2pyFaduhjLax3LUN%252BdmyxCPVA38asq087nkAFlAv0NNSQUcsx%2FA%3D%3D; ComponentLink3Description: ProductPage; ComponentLink3URL: https://www.ti.com/store/ti/en/p/product/?p=PCF8574RGYR; Case: VQFN-20; Maximum Operating Temperature: +85; Minimum Operating Temperature: -40; Supplier 1: Digi-Key; Supplier 2: Mouser; Supplier Part Number 1: 296-15173-1-ND; Supplier Part Number 2: 595-PCF8574RGYR

## Sheet Reserved Sensor Output Socket.SchDoc: Reserved Sensor Output Socket
size A4; ApprovedBy: Mehmet Günce Akkoyun; CheckedBy: Mehmet Günce Akkoyun; Author: Mehmet Günce Akkoyun; CompanyName: Ovoo Electronics; DrawnBy: Mehmet Günce Akkoyun; Engineer: Mehmet Günce Akkoyun; Organization: Ovoo Electronics; Address1: Küçük Ýhsaniye Mah.; Address2: Mýzraklý Sok. No:15; Address3: Meram / Konya; Address4: Turkiye; DocumentNumber: AA005; Revision: B106AA; SheetNumber: 34; SheetTotal: 37
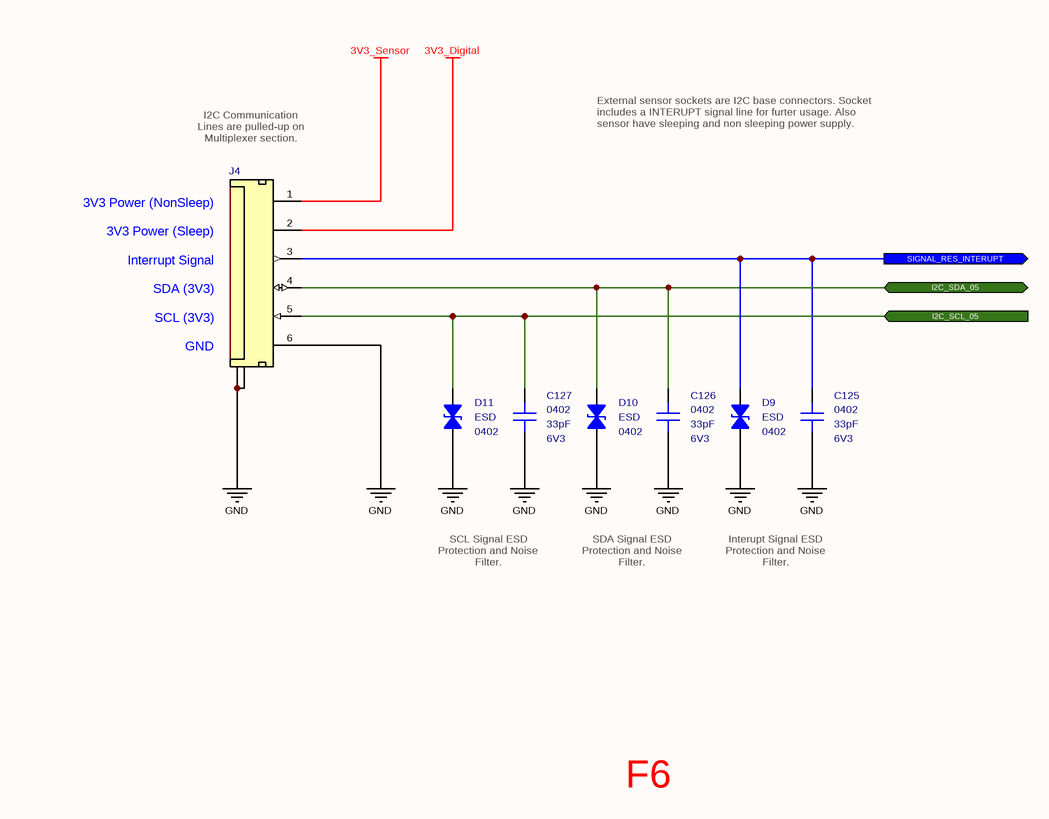
[diagram p41: Reserved Sensor Output Socket.SchDoc]

### Parts
C125  value 33pF  Case: 0402  Voltage: 6V3  [CAPACITOR_0402]  (hidden comment: Multilayer Ceramic Capacitor)
C126  value 33pF  Case: 0402  Voltage: 6V3  [CAPACITOR_0402]  (hidden comment: Multilayer Ceramic Capacitor)
C127  value 33pF  Case: 0402  Voltage: 6V3  [CAPACITOR_0402]  (hidden comment: Multilayer Ceramic Capacitor)
D9  Case: 0402  [ESD_0402]  (hidden comment: ESD Suppressors)
D10  Case: 0402  [ESD_0402]  (hidden comment: ESD Suppressors)
D11  Case: 0402  [ESD_0402]  (hidden comment: ESD Suppressors)
J4  6P Tunic Connector  [Connector_Tunic 6P - H]  (value not drawn)

### Ports
I2C_SCL_05 (in), I2C_SDA_05 (bidir), SIGNAL_RES_INTERUPT (out)

### Nets
3V3_Digital: J4.2(M_DRV)
3V3_Sensor: J4.1(VBAT)
GND: C125.1 C126.1 C127.1 D9.1 D10.1 D11.1 J4.6(M_DRV) J4.7(GND) J4.8(GND)
I2C_SCL_05: C127.2 D11.2 J4.5(M_DRV) ; port I2C_SCL_05
I2C_SDA_05: C126.2 D10.2 J4.4(M_DRV) ; port I2C_SDA_05
SIGNAL_RES_INTERUPT: C125.2 D9.2 J4.3(M_DRV) ; port SIGNAL_RES_INTERUPT

### Notes on the sheet
- I2C Communication Lines are pulled-up on Multiplexer section.
- External sensor sockets are I2C base connectors. Socket includes a INTERUPT signal line for furter usage. Also sensor have sleeping and non sleeping power supply.
- (near J4) 3V3 Power (NonSleep)
  3V3 Power (Sleep)
  Interrupt Signal
  SDA (3V3)
  SCL (3V3)
  GND
- SCL Signal ESD Protection and Noise Filter.
- SDA Signal ESD Protection and Noise Filter.
- Interupt Signal ESD Protection and Noise Filter.
- F6
- Title
- Size:
- Date:
- A4
- Number:
- Time:
- Revision:
- Sheet
- of
- File:
- (in symbol Diode - ESD Protection) ESD

### Library data of the parts
C125-C127 = Capacitor - 33pF [0402-6V3]: as C128 on sheet TH Sensor Output Socket; Height: 0.5mm; Mouser_Part_Number: 80-C0402C330J9RAUTO; Maximum Operating Temperature: +125; Minimum Operating Temperature: -55; ROHS: Yes; ComponentLink1Description: DataSheet; ComponentLink1URL: https://api.kemet.com/component-edge/download/datasheet/C0402C330J9RACAUTO.pdf; ComponentLink2Description: Mouser; ComponentLink2URL: https://www.mouser.com/Search/Refine.aspx?Keyword=80-C0402C330J9RAUTO; Supplier 1: Mouser; Supplier Part Number 1: 80-C0402C330J9RAUTO
D9-D11 = Diode - ESD Protection: as D12 on sheet TH Sensor Output Socket; Height: 0.436mm; Mouser_Part_Number: 504-0402ESDA-MLP1; Maximum Operating Temperature: +125; Minimum Operating Temperature: -55; ROHS: Yes; ComponentLink1Description: DataSheet; ComponentLink1URL: https://www.mouser.com.tr/datasheet/2/87/47c59e11-d058-4882-bc35-d8572f2ca054-38826.pdf; ComponentLink2Description: Mouser; ComponentLink2URL: https://www.mouser.com.tr/ProductDetail/Bussmann-Eaton/0402ESDA-MLP1?qs=%2Fha2pyFadughxyc7TyLWeW%2FUvipVY6Ex3naV%2FjpO3plZBZWDLqV4bw%3D%3D; Supplier 1: Mouser; Supplier 2: Digi-Key; Supplier Part Number 2: 283-2964-1-ND; Supplier Part Number 1: 504-0402ESDA-MLP1
J4 = Connector - Mini Tunic 6P (1.25): as J5 on sheet TH Sensor Output Socket; ROHS: Yes; Supplier 1: Avnet; Supplier 2: Mouser; Supplier 3: Arrow; Supplier 4: Farnell; Supplier 5: Newark; Supplier 6: Digi-Key; Supplier Part Number 1: 0532610671; Supplier Part Number 2: 538-53261-0671; Supplier Part Number 3: 53261-0671; Supplier Part Number 4: 1125375; Supplier Part Number 5: 93K4246; Supplier Part Number 6: WM7624CT-ND

## Sheet Signal Latch Logic.SchDoc: Signal Latch Logic
size A4; ApprovedBy: Mehmet Günce Akkoyun; CheckedBy: Mehmet Günce Akkoyun; Author: Mehmet Günce Akkoyun; CompanyName: Ovoo Electronics; DrawnBy: Mehmet Günce Akkoyun; Engineer: Mehmet Günce Akkoyun; Organization: Ovoo Electronics; Address1: Küçük Ýhsaniye Mah.; Address2: Mýzraklý Sok. No:15; Address3: Meram / Konya; Address4: Turkiye; DocumentNumber: AA005; Revision: B106AA; SheetNumber: 37; SheetTotal: 37
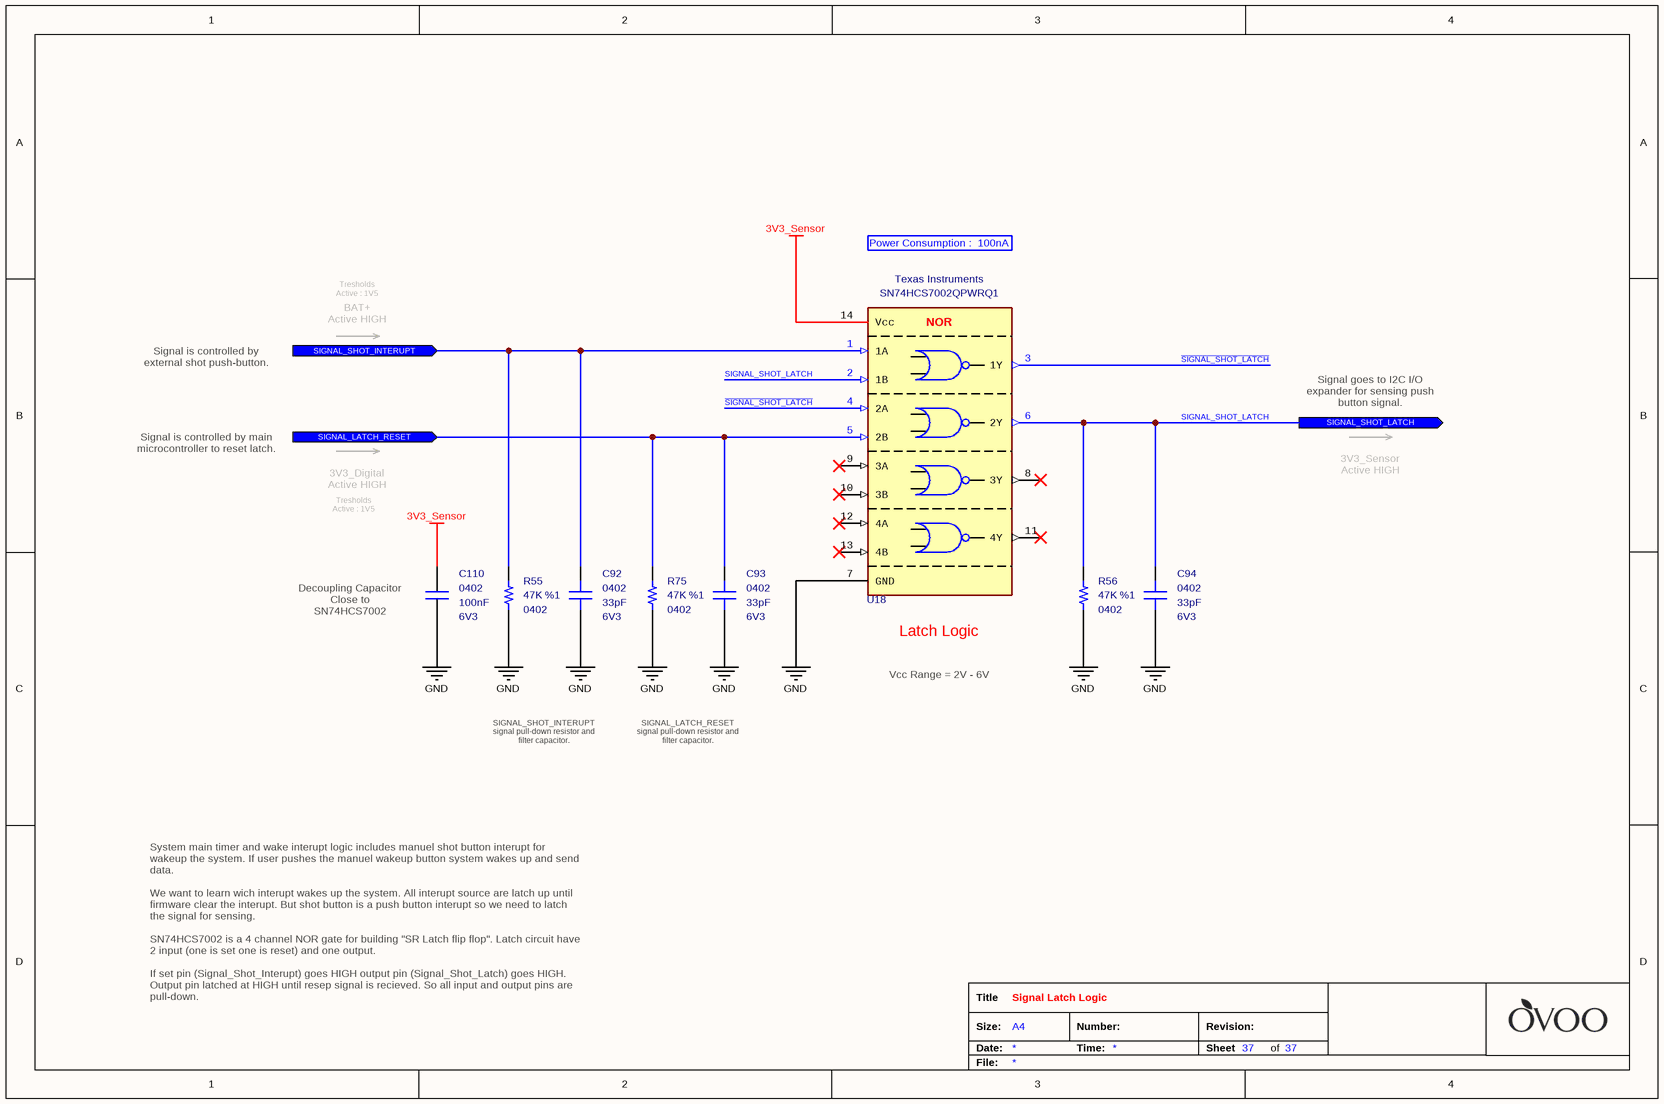
[diagram p42: Signal Latch Logic.SchDoc]

### Parts
C92  value 33pF  Case: 0402  Voltage: 6V3  [CAPACITOR_0402]  (hidden comment: Multilayer Ceramic Capacitor)
C93  value 33pF  Case: 0402  Voltage: 6V3  [CAPACITOR_0402]  (hidden comment: Multilayer Ceramic Capacitor)
C94  value 33pF  Case: 0402  Voltage: 6V3  [CAPACITOR_0402]  (hidden comment: Multilayer Ceramic Capacitor)
C110  value 100nF  Case: 0402  Voltage: 6V3  [CAPACITOR_0402]  (hidden comment: Multilayer Ceramic Capacitor)
R55  value 47K  Tolerance: %1  Case: 0402  [RESISTOR_0402]  (hidden comment: Thick Film Resistor)
R56  value 47K  Tolerance: %1  Case: 0402  [RESISTOR_0402]  (hidden comment: Thick Film Resistor)
R75  value 47K  Tolerance: %1  Case: 0402  [RESISTOR_0402]  (hidden comment: Thick Film Resistor)
U18  Manufacturer_Part_Number: SN74HCS7002QPWRQ1  Manufacturer_Name: Texas Instruments  [TSSOP-14]  (hidden comment: Logic Gate (NOR))

### Ports
SIGNAL_LATCH_RESET (in), SIGNAL_SHOT_INTERUPT (in), SIGNAL_SHOT_LATCH (out)

### Nets
3V3_Sensor: C110.2 U18.14(Vcc)
GND: C92.1 C93.1 C94.1 C110.1 R55.1 R56.1 R75.1 U18.7(GND)
~{SIGNAL_SHOT_LATCH}: U18.3(1Y) U18.4(2A)
SIGNAL_SHOT_INTERUPT: C92.2 R55.2 U18.1(1A) ; port SIGNAL_SHOT_INTERUPT
SIGNAL_SHOT_LATCH: C94.2 R56.2 U18.2(1B) U18.6(2Y) ; port SIGNAL_SHOT_LATCH
NetC93_2: C93.2 R75.2 U18.5(2B) ; port SIGNAL_LATCH_RESET

Not connected (* = marked no-connect by the designer): U18 8(3Y)* 9(3A)* 10(3B)* 11(4Y)* 12(4A)* 13(4B)*

### Notes on the sheet
- Power Consumption :  100nA
- BAT+
  Active HIGH
- Tresholds
  Active : 1V5
- Signal is controlled by external shot push-button.
- Signal goes to I2C I/O expander for sensing push button signal.
- Signal is controlled by main microcontroller to reset latch.
- 3V3_Sensor
  Active HIGH
- 3V3_Digital
  Active HIGH
- (near C110) Decoupling Capacitor
  Close to SN74HCS7002
  Pin-14 (Vcc)
- Vcc Range = 2V - 6V
- (near U18) Latch Logic
- SIGNAL_SHOT_INTERUPT signal pull-down resistor and filter capacitor.
- SIGNAL_LATCH_RESET signal pull-down resistor and filter capacitor.
- System main timer and wake interupt logic includes manuel shot button interupt for wakeup the system. If user pushes the manuel wakeup button system wakes up and send data.
  We want to learn wich interupt wakes up the system. All interupt source are latch up until firmware clear the interupt. But shot button is a push button interupt so we need to latch the signal for sensing.
  SN74HCS7002 is a 4 channel NOR gate for building "SR Latch flip flop". Latch circuit have 2 input (one is set one is reset) and one output.
  If set pin (Signal_Shot_Interupt) goes HIGH output pin (Signal_Shot_Latch) goes HIGH. Output pin latched at HIGH until resep signal is recieved. So all input and output pins are pull-down.
- Title
- Size:
- Date:
- A4
- Number:
- Time:
- Revision:
- Sheet
- of
- File:
- (in symbol IC - SN74HCS7002QPWRQ1) NOR

### Library data of the parts
C92-C94 = Capacitor - 33pF [0402-6V3]: as C128 on sheet TH Sensor Output Socket; Height: 0.5mm; Mouser_Part_Number: 80-C0402C330J9RAUTO; Maximum Operating Temperature: +125; Minimum Operating Temperature: -55; ROHS: Yes; ComponentLink1Description: DataSheet; ComponentLink1URL: https://api.kemet.com/component-edge/download/datasheet/C0402C330J9RACAUTO.pdf; ComponentLink2Description: Mouser; ComponentLink2URL: https://www.mouser.com/Search/Refine.aspx?Keyword=80-C0402C330J9RAUTO; Supplier 1: Mouser; Supplier Part Number 1: 80-C0402C330J9RAUTO
C110 = Capacitor - 100nF [0402-6V3]: as C7 on sheet Pressure Sensor; Height: 0.25mm; Mouser_Part_Number: 581-04026D104KAT4A; ComponentLink1Description: Mouser; ComponentLink1URL: https://www.mouser.com.tr/ProductDetail/AVX/04026D104KAT4A?qs=sGAEpiMZZMs0AnBnWHyRQPg4iYkCw7IMED%2F4kpqgf7w%3D; ComponentLink2Description: DataSheet; ComponentLink2URL: https://www.mouser.com.tr/datasheet/2/40/cx5r-776519.pdf; ROHS: Yes; Maximum Operating Temperature: +85; Minimum Operating Temperature: -55; Supplier 1: Avnet; Supplier Part Number 1: 04026D104KAT4A
R55 R56 R75 = Resistor - 47K: Thick Film Resistors - SMD 1/16 W 47 Kohms 1%; Manufacturer_Name: Vishay; Manufacturer_Part_Number: CRCW040247K0FKED; Height: 0.4mm; Mouser_Part_Number: 71-CRCW0402-47K-E3; ComponentLink1Description: DataSheet; ComponentLink1URL: https://www.mouser.com.tr/datasheet/2/427/dcrcwe3-1762152.pdf; ComponentLink2Description: Mouser; ComponentLink2URL: https://www.mouser.com.tr/ProductDetail/Vishay-Dale/CRCW040247K0FKED?qs=sGAEpiMZZMu61qfTUdNhG2DpbjADlD3GL%252B3h1elTxqU%3D; Supplier 1: Mouser; Supplier 2: Digi-Key; Supplier Part Number 1: 71-CRCW040247K0FKEDH; Supplier Part Number 2: 541-47.0KYCT-ND
U18 = IC - SN74HCS7002QPWRQ1: Logic Gates Quadruple 2-input NOR gates with Schmitt-trigger inputs 14-TSSOP -40 to 125; Mouser_Part_Number: 595-N74HCS7002QPWRQ1; ComponentLink1Description: DataSheet; ComponentLink1URL: http://www.ti.com/lit/ds/symlink/sn74hcs7002-q1.pdf; ComponentLink2Description: Mouser; ComponentLink2URL: https://www.mouser.com.tr/ProductDetail/Texas-Instruments/SN74HCS7002QPWRQ1?qs=B6kkDfuK7%2FD8gt2COF3EEA%3D%3D; Minimum Operating Temperature: -40; Maximum Operating Temperature: +125; Case: TSSOP-14; Supplier 1: Mouser; Supplier 2: Digi-Key; Supplier Part Number 1: 595-N74HCS7002QPWRQ1; Supplier Part Number 2: 296-SN74HCS7002QPWRQ1CT-ND

## Nets that join several sheets
3V3_Digital: Master MicroController (7 pins), FOTA MicroController Power Switch (C12.1 U4.1), SD Card Selection Multiplexer (C71.1 U14.16), SD Card Module (5 pins), Bidirectional Voltage Translator (6 pins), 3V3 LDO Regulator (Sleeping) (5 pins), Battery Measurement (C89.1 U16.1), I2C Multiplexer (21 pins), TH Sensor Output Socket (J5.2), ST Sensor Output Socket (J7.2), Real Time Clock (D2.2), I2C IO Expander (C91.2 U22.5), Reserved Sensor Output Socket (J4.2)
3V3_FOTA: FOTA MicroController Power Switch (R21.1 U4.6), FOTA MicroController (7 pins), FOTA MicroController Status LEDs (6 pins)
3V3_Sensor: FOTA MicroController Power Trigger (C11.2 U3.1), 3V3 LDO Regulator (NonSleeping) (5 pins), TH Sensor Output Socket (J5.1), ST Sensor Output Socket (J7.1), Pressure Sensor (C7.2 U5.1 U5.4), Capacitive Rain Sensor (C1.2 U1.7), Real Time Clock (C28.2 U6.7), Reserved Sensor Output Socket (J4.1), Signal Latch Logic (C110.2 U18.14)
3V8: GSM Power On-Off Switch IC (C3.2 C5.1 U2.1), 3V3 LDO Regulator (NonSleeping) (C107.1 U24.1 U24.3), 3V3 LDO Regulator (Sleeping) (C106.1 U23.1), Buck Boost Converter (7 pins)
BAT+: Time Management (C44.2 Q7.3 U9.1 U9.6), System Wake Interupt Logic (6 pins), Manuel Wake-up and Latch (J6.1), Battery Feed and Socket (7 pins), Battery Measurement (7 pins), Battery Charger (5 pins)
GND: Master MicroController (10 pins), FOTA MicroController Power Trigger (6 pins), FOTA MicroController Power Switch (C12.2 C13.1 R8.1 U4.2), SD Card Selection Multiplexer (5 pins), SD Card Module (C42.1 J2.2 J2.6), FOTA MicroController (10 pins), FOTA MicroController Status LEDs (15 pins), GSM Signal Control (6 pins), GE910QUAD Modem (57 pins), GSM LED Indicators (15 pins), Bidirectional Voltage Translator (16 pins), Time Management (8 pins), System Wake Interupt Logic (14 pins), Manuel Wake-up and Latch (5 pins), GSM Power On-Off Switch IC (13 pins), 3V3 LDO Regulator (NonSleeping) (5 pins), 3V3 LDO Regulator (Sleeping) (5 pins), Battery Feed and Socket (J8.3 J8.4), Battery Measurement (8 pins), Battery Charger (22 pins), Buck Boost Converter (10 pins), I2C Multiplexer (6 pins), TH Sensor Output Socket (9 pins), ST Sensor Output Socket (9 pins), Pressure Sensor (C7.1 C8.1 C27.1 U5.3), Capacitive Rain Sensor (7 pins), Real Time Clock (7 pins), I2C IO Expander (6 pins), Reserved Sensor Output Socket (9 pins), Signal Latch Logic (8 pins)
PACK-: Battery Feed and Socket (R74.1 U25.6), Battery Measurement (5 pins)
VCC: Battery Charger (5 pins), Buck Boost Converter (5 pins)
VIOT: GSM LED Indicators (6 pins), GSM Power On-Off Switch IC (7 pins)
FOTA_DIGITAL_MISO: SD Card Selection Multiplexer (U14.3), FOTA MicroController (TP42.1 U13.30)
FOTA_DIGITAL_MOSI: SD Card Selection Multiplexer (U14.6), FOTA MicroController (TP45.1 U13.31)
FOTA_DIGITAL_RESET: SD Card Selection Multiplexer (U14.13), FOTA MicroController (TP48.1 U13.1)
FOTA_DIGITAL_SCK: SD Card Selection Multiplexer (U14.10), FOTA MicroController (TP47.1 U13.32)
FOTA_MISO: SD Card Module (R30.1), FOTA MicroController (TP36.1 U13.16)
FOTA_MOSI: SD Card Module (R25.1), FOTA MicroController (TP39.1 U13.15)
FOTA_SCK: SD Card Module (R28.1), FOTA MicroController (TP40.1 U13.17)
GSM_1V8_DTR: GE910QUAD Modem (U10.M14), Bidirectional Voltage Translator (C139.2 U7.12)
GSM_1V8_ONOFF: GSM Signal Control (Q10.3), GE910QUAD Modem (U10.R12)
GSM_1V8_PMON: GE910QUAD Modem (U10.R11), GSM LED Indicators (C16.1 Q2.1 R10.2), Bidirectional Voltage Translator (5 pins)
GSM_1V8_RX: GE910QUAD Modem (U10.N15), Bidirectional Voltage Translator (C78.2 TP9.1 U7.13)
GSM_1V8_SDOWN: GSM Signal Control (Q9.3), GE910QUAD Modem (U10.R13)
GSM_1V8_STAT: GE910QUAD Modem (U10.C08), GSM LED Indicators (C19.1 Q3.1 R12.2)
GSM_1V8_TX: GE910QUAD Modem (U10.M15), Bidirectional Voltage Translator (C77.2 TP14.1 U7.11)
GSM_1V8_TXMON: GE910QUAD Modem (U10.B14), GSM LED Indicators (C22.1 Q4.1 R14.2)
GSM_3V3_DTR: Master MicroController (U12.9), Bidirectional Voltage Translator (C138.2 R91.1 U7.5)
GSM_3V3_ONOFF: Master MicroController (U12.24), GSM Signal Control (R83.2 TP49.1)
GSM_3V3_PMON: Master MicroController (U12.26), Bidirectional Voltage Translator (C73.2 R44.2 TP18.1 U7.7)
GSM_3V3_RX: Master MicroController (U12.31), Bidirectional Voltage Translator (C75.2 TP8.1 U7.4)
GSM_3V3_SDOWN: Master MicroController (U12.25), GSM Signal Control (R65.2 TP61.1)
GSM_3V3_TX: Master MicroController (U12.30), Bidirectional Voltage Translator (C74.2 TP13.1 U7.6)
I2C_SCL: Master MicroController (TP44.1 U12.28), I2C Multiplexer (R47.1 U17.22)
I2C_SCL_01: I2C Multiplexer (R88.1 TP51.1 U17.5), TH Sensor Output Socket (C130.2 D14.2 J5.5)
I2C_SCL_02: I2C Multiplexer (R90.1 TP52.1 U17.7), ST Sensor Output Socket (C134.2 D18.2 J7.5)
I2C_SCL_03: I2C Multiplexer (R18.1 TP53.1 U17.9), Pressure Sensor (U5.8)
I2C_SCL_04: I2C Multiplexer (R2.1 TP54.1 U17.11), Capacitive Rain Sensor (U1.1)
I2C_SCL_05: I2C Multiplexer (R86.1 TP55.1 U17.14), Reserved Sensor Output Socket (C127.2 D11.2 J4.5)
I2C_SCL_06: I2C Multiplexer (R53.1 TP56.1 U17.16), I2C IO Expander (U22.2)
I2C_SCL_07: I2C Multiplexer (R5.1 TP57.1 U17.18), Real Time Clock (U6.3)
I2C_SCL_08: Battery Measurement (U16.2), I2C Multiplexer (R51.1 TP58.1 U17.20)
I2C_SDA: Master MicroController (TP46.1 U12.27), I2C Multiplexer (R49.1 U17.23)
I2C_SDA_01: I2C Multiplexer (R87.1 TP64.1 U17.4), TH Sensor Output Socket (C129.2 D13.2 J5.4)
I2C_SDA_02: I2C Multiplexer (R89.1 TP65.1 U17.6), ST Sensor Output Socket (C133.2 D17.2 J7.4)
I2C_SDA_03: I2C Multiplexer (R19.1 TP66.1 U17.8), Pressure Sensor (U5.7)
I2C_SDA_04: I2C Multiplexer (R1.1 TP67.1 U17.10), Capacitive Rain Sensor (U1.2)
I2C_SDA_05: I2C Multiplexer (R85.1 TP68.1 U17.13), Reserved Sensor Output Socket (C126.2 D10.2 J4.4)
I2C_SDA_06: I2C Multiplexer (R54.1 TP69.1 U17.15), I2C IO Expander (U22.4)
I2C_SDA_07: I2C Multiplexer (R6.1 TP70.1 U17.17), Real Time Clock (U6.4)
I2C_SDA_08: Battery Measurement (U16.3), I2C Multiplexer (R63.1 TP71.1 U17.19)
MASTER_MISO: Master MicroController (TP37.1 U12.16), SD Card Selection Multiplexer (U14.4)
MASTER_MOSI: Master MicroController (TP33.1 U12.15), SD Card Selection Multiplexer (U14.7)
MASTER_RESET: Master MicroController (C72.2 R46.1 TP24.1 U12.29), SD Card Selection Multiplexer (U14.12)
MASTER_SCK: Master MicroController (TP31.1 U12.17), SD Card Selection Multiplexer (U14.9)
NetC13_2: FOTA MicroController Power Trigger (U3.5), FOTA MicroController Power Switch (C13.2 R8.2 TP12.1 U4.3)
NetC25_1: FOTA MicroController (U13.23), FOTA MicroController Status LEDs (C25.1 Q5.1 R16.2)
NetC30_2: FOTA MicroController Power Trigger (C30.2 R20.2 TP17.1 U3.4), FOTA MicroController (U13.12)
NetC39_1: FOTA MicroController (U13.24), FOTA MicroController Status LEDs (C39.1 Q6.1 R24.2)
NetC47_1: Master MicroController (U12.1), Battery Charger (C47.1 TP21.1 U8.8)
NetC60_1: Master MicroController (U12.2), Battery Charger (C60.1 TP23.1 U8.7)
NetC64_1: Master MicroController (U12.32), Battery Charger (C64.1 TP26.1 U8.6)
NetC67_1: FOTA MicroController (U13.25), FOTA MicroController Status LEDs (C67.1 Q8.1 R39.2)
NetC69_2: SD Card Selection Multiplexer (C69.2 R41.2 TP22.1 U14.1), FOTA MicroController (U13.13)
NetC93_2: Master MicroController (U12.14), Signal Latch Logic (C93.2 R75.2 U18.5)
NetC97_2: Master MicroController (U12.10), Battery Measurement (C97.2 R50.2 U16.5)
NetJ2_3: SD Card Selection Multiplexer (U14.5), SD Card Module (J2.3 R25.2 R26.1 TP5.1)
NetJ2_5: SD Card Selection Multiplexer (U14.11), SD Card Module (J2.5 R27.1 R28.2 TP3.1)
NetJ2_7: SD Card Selection Multiplexer (U14.2), SD Card Module (J2.7 R29.1 R30.2 TP1.1)
NetQ7_1: Time Management (Q7.1), System Wake Interupt Logic (5 pins)
NetR7_2: Master MicroController (U12.12), FOTA MicroController Power Trigger (R7.2 U3.3)
SIGNAL_GAUGE_ALERT: System Wake Interupt Logic (C96.2 R62.1 U20.4 U20.5), Battery Measurement (R70.1 U21.8), I2C IO Expander (U22.19)
SIGNAL_IOT_COM_EN: Master MicroController (U12.23), Bidirectional Voltage Translator (R43.1 TP7.1 U7.14 U7.15)
SIGNAL_IOT_POWER_EN: Master MicroController (U12.13), GSM Power On-Off Switch IC (C4.2 R3.2 TP2.1 U2.3)
SIGNAL_P_INTERUPT: System Wake Interupt Logic (C111.2 R80.1 U20.12 U20.13), Pressure Sensor (C27.2 U5.5 U5.6), I2C IO Expander (U22.16)
SIGNAL_R_INTERUPT: System Wake Interupt Logic (R77.2 TP73.1 U19.12), Capacitive Rain Sensor (C2.2 U1.5), I2C IO Expander (U22.11)
SIGNAL_RES_INTERUPT: System Wake Interupt Logic (R78.2 TP74.1 U19.10), I2C IO Expander (U22.14), Reserved Sensor Output Socket (C125.2 D9.2 J4.3)
SIGNAL_RTC_INTERUPT: System Wake Interupt Logic (C95.2 R61.1 U20.1 U20.2), Real Time Clock (C10.1 U6.2), I2C IO Expander (U22.20)
SIGNAL_SHOT_INTERUPT: System Wake Interupt Logic (R79.2 TP75.1 U19.9), Manuel Wake-up and Latch (C131.2 D15.2 J6.3), Signal Latch Logic (C92.2 R55.2 U18.1)
SIGNAL_SHOT_LATCH: I2C IO Expander (U22.12), Signal Latch Logic (C94.2 R56.2 U18.2 U18.6)
SIGNAL_ST_INTERUPT: System Wake Interupt Logic (C112.2 R81.1 U20.9 U20.10), ST Sensor Output Socket (C132.2 D16.2 J7.3), I2C IO Expander (U22.17)
SIGNAL_TH_INTERUPT: System Wake Interupt Logic (R76.2 TP72.1 U19.13), TH Sensor Output Socket (C128.2 D12.2 J5.3), I2C IO Expander (U22.10)
SIGNAL_TIMER_DONE: Master MicroController (U12.11), Time Management (C63.2 R37.2 TP28.1 U9.4)
SIGNAL_TIMER_DRVn: Time Management (C59.2 R33.2 TP29.1 U9.5), 3V3 LDO Regulator (Sleeping) (U23.3)
VIOT1: GE910QUAD Modem (U10.M01 U10.M02), GSM Power On-Off Switch IC (C99.1 C101.2 C102.2 FB1.2)
VIOT2: GE910QUAD Modem (U10.N01 U10.N02 U10.P01 U10.P02), GSM Power On-Off Switch IC (C103.2 C104.2 C105.1 FB2.2)

## Assembly variants
Prototype: all parts fitted
Bulk Production: not fitted C41 C41 C42 C42 C43 C43 C44 C44 C45 C45 C46 C46 C47 C47 C48 C48 C49 C50 C51 C52 C53 C54 C54 C55 C55 C58 C59 C60 C61 C62 C63 C64 C65 C66 C90 C91 C92 C100 C101 C102 C103 C103 C104 C104 C106 C107 C108 C? C? D1 D1 D3 D3 D3 D4 D4 D4 D5 D6 D6 D6 D7 D7 D8 D8 D9 D16 D17 D18 D18 D19 J1 J1 J5 J10 L2 L2 L3 L3 L? L? Q1 Q1 Q2 Q2 Q2 Q3 Q4 Q6 Q6 Q7 Q8 Q9 Q10 R24 R24 R24 R25 R25 R25 R26 R26 R26 R27 R27 R27 R28 R29 R46 R46 R48 R62 R63 R64 R65 R66 R67 R85 U11 U11